# EAGLE design ChipPlatine (EAGLE 9.6.2)
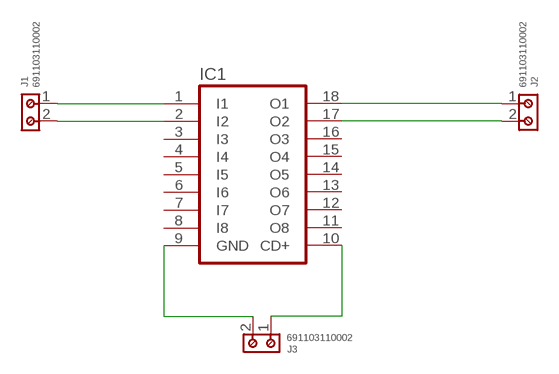
[diagram p0: schematic, sheet 1]

## Parts
IC1  ULN2803A  [DIL18]
J1  691103110002  [691103110002]
J2  691103110002  [691103110002]
J3  691103110002  [691103110002]

## Nets
N$1: IC1.1(I1) J1.1
N$2: IC1.2(I2) J1.2
N$3: IC1.18(O1) J2.1
N$4: IC1.17(O2) J2.2
N$5: IC1.9(GND) J3.2
N$6: IC1.10(CD+) J3.1
Unconnected: IC1.3(I3) IC1.4(I4) IC1.5(I5) IC1.6(I6) IC1.7(I7) IC1.8(I8) IC1.11(O8) IC1.12(O7) IC1.13(O6) IC1.14(O5) IC1.15(O4) IC1.16(O3)

## Library data of the parts
IC1 = uln-udn:ULN2803A: DRIVER ARRAY
J1-J3 = Wurth_Connectors_WR-TBL Wire Protector:691103110002: WR-TBL Serie 1031 - 3.50 mm Horiz. Entry Modular KIND PROPERTIES Pitch 3.5 mm MATERIAL PROPERTIES Insulator Material PA66 Insulator Flammability Rating UL94 V-0 Insulator Color Blue Contact Material Brass Contact Plating Copper over Zinc Terminal Screw Material Steel Terminal Screw Plating Zinc Wire Guard Material Stainless Steel GENERAL INFORMATION Operating Temperature -40 up to +105 °C Compliance Lead free / RoHS ELECTRICAL PROPERTIES IR UL 10 A Working Voltage [UL] 125 V (AC) Withstanding Voltage [UL] 1250 V (AC) Contact Resistance 20 mΩ Contact Resistance [UL] 20 mΩ MECHANICAL PROPERTIES Wire Strip Length 5 up to 6 (mm) Screw M2 Solid Wire Section (AWG) 26 to 16 (AWG) Solid Wire Section (Metric) 0.129 to 1.31 (mm²) Stranded Wire Section (AWG) 26 to 16 (AWG) Stranded Wire Section (Metric) 0.129 to 1.31 (mm²) CERTIFICATION UL Approval E315414 PACKAGING PROPERTIES Packaging Box <https://katalog.we-online.com/media/images/v2/o33226v209%20Family_WR-TBL_69110311000x.jpg> Details see: https://katalog.we-online.com/en/em/TBL_3_50_1031_6911031100XX Updated by Ella Wu 2019-11-07 2019(C) Wurth Elektronik; DATASHEET-URL: https://www.we-online.com/catalog/datasheet/691103110002.pdf; IR-UL: 10A; MOUNT: THT; PART-NUMBER: 691103110002; PINS: 2; PITCH: 3.5mm; TYPE: Horizontal; WIRE: 26 to 16 (AWG) 0.129 to 1.31 (mm²); WORKING-VOLTAGE-UL: 125V(AC)

## Board
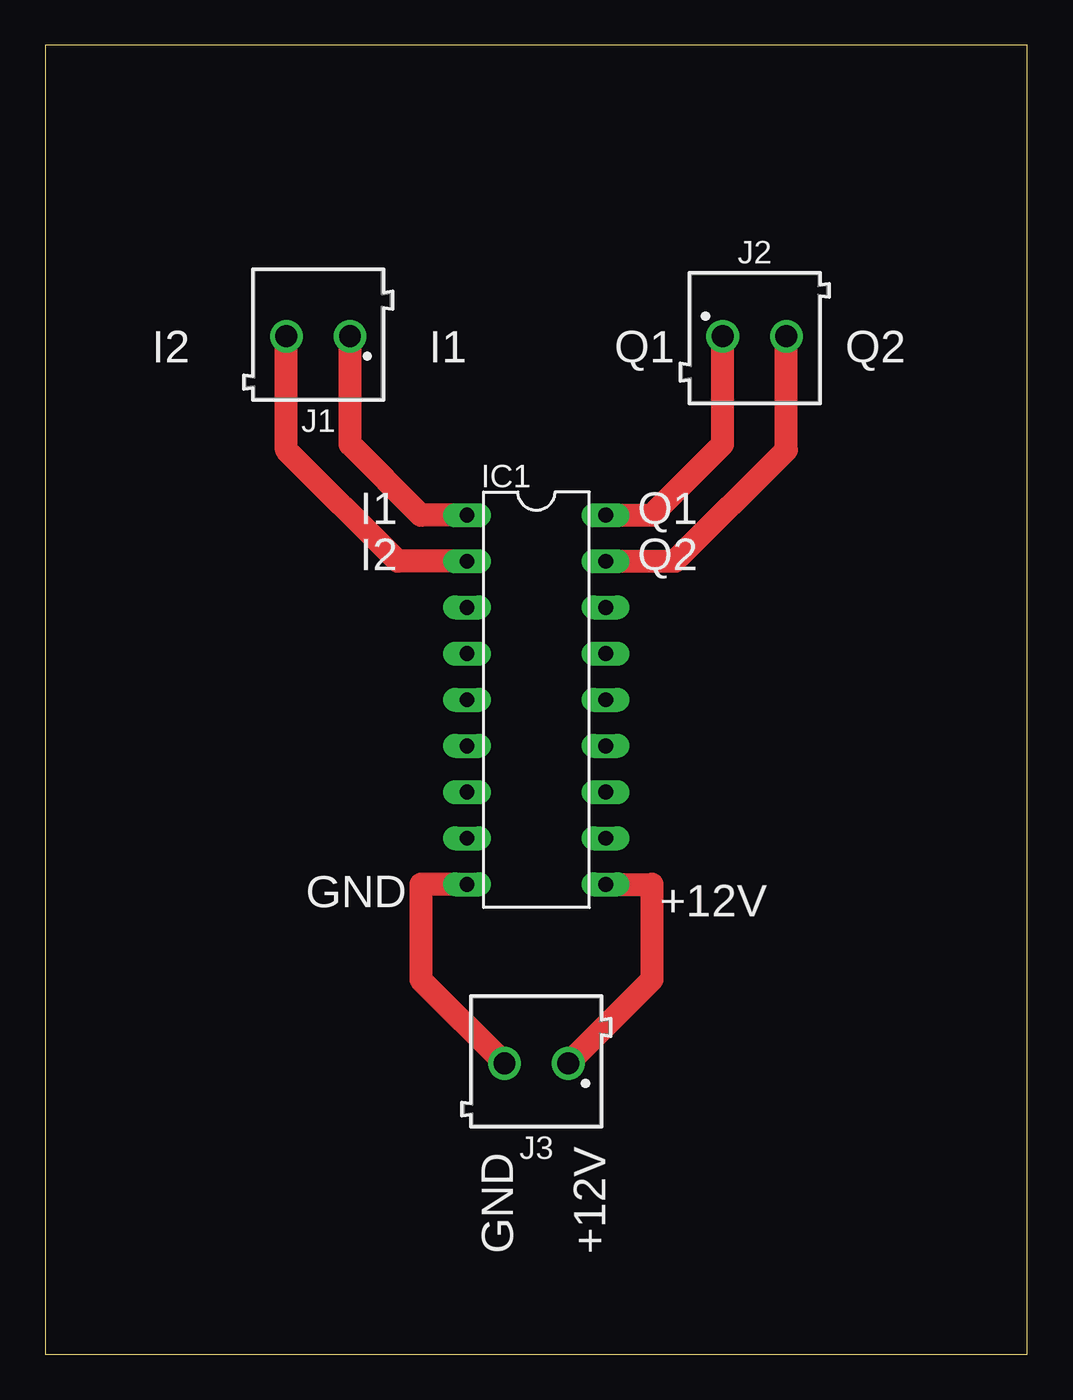
[diagram p1: board, top side]

Size 54 x 72 mm. Coordinates in mm from the lower left corner, seen from the top.
Outline: 0,0 54,0 54,72 0,72 0,0
Copper layers (1*16): Top 0.035mm / dielectric 1.5mm / Bottom 0.035mm
Design rules "default": minimum track width 6mil, minimum drill 0.35mm, track to track 6mil, track to pad 6mil, pad to pad 6mil, via to via 6mil, smd to smd 6mil, copper to edge 40mil, drill to drill 6mil, minimum pad ring 10mil, minimum via ring 8mil, stop-mask expansion 4mil, vias tented up to drill 0mil, thermal gap 10mil

### Footprints (pad centres in the part's own frame; a part is rotated, then mirrored left to right if it is on the bottom)
DIL18 = drill 0.813 long: 1 -10.16,-3.81; 2 -7.62,-3.81; 3 -5.08,-3.81; 4 -2.54,-3.81; 5 0,-3.81; 6 2.54,-3.81; 7 5.08,-3.81; 8 7.62,-3.81; 9 10.16,-3.81; 10 10.16,3.81; 11 7.62,3.81; 12 5.08,3.81; 13 2.54,3.81; 14 0,3.81; 15 -2.54,3.81; 16 -5.08,3.81; 17 -7.62,3.81; 18 -10.16,3.81
691103110002 = drill 1.2: 1 -1.75,0; 2 1.75,0

### Placement (x,y rotation side)
IC1  27,36 270 top
J1  15,56 180 top
J2  39,56 0 top
J3  27,16 180 top

### Tracks (layer width: path | path; a pad name or v marks a point on that pad's centre or on a via)
N$1
  Top 1.27: IC1.1 20.65,46.16 16.75,50.06 J1.1
N$2
  Top 1.27: IC1.2 19.38,43.62 13.25,49.75 J1.2
N$3
  Top 1.27: IC1.18 33.35,46.16 37.25,50.06 J2.1
N$4
  Top 1.27: IC1.17 34.62,43.62 40.75,49.75 J2.2
N$5
  Top 1.27: IC1.9 20.65,25.84 20.65,20.6 J3.2
N$6
  Top 1.27: IC1.10 33.35,25.84 33.35,20.6 J3.1

### Text on the board
tNames: I2 | I1 | Q1 | Q2 | I1 | Q1 | I2 | Q2 | +12V | GND | GND | +12V